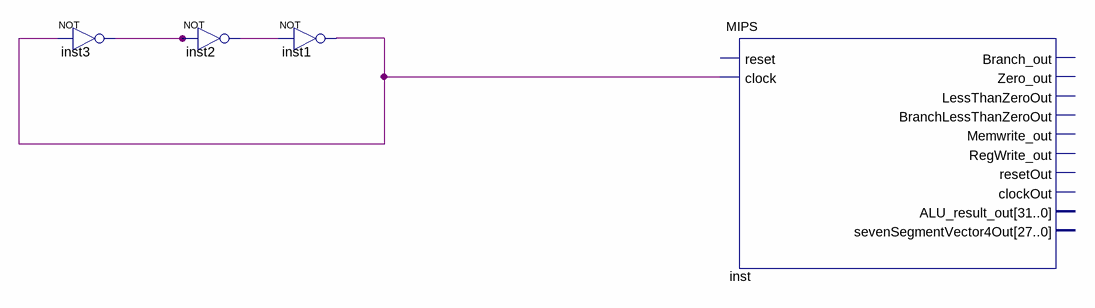
[diagram p0: schematic sheet]
// Quartus schematic clock.bdf as structural Verilog: 4 symbols, 0 pins
module clock (
);

  wire inst1_out, inst2_out, inst3_out;

  not inst3 (inst3_out, inst1_out);
  not inst2 (inst2_out, inst3_out);
  not inst1 (inst1_out, inst2_out);
  MIPS inst (.clock(inst1_out));  // open: reset, Branch_out, Zero_out, LessThanZeroOut, BranchLessThanZeroOut, Memwrite_out, RegWrite_out, resetOut, clockOut, ALU_result_out, sevenSegmentVector4Out
endmodule
